# Altium schematic sheet 08 BESIDE CPU.SchDoc
size 420 x 297 mm
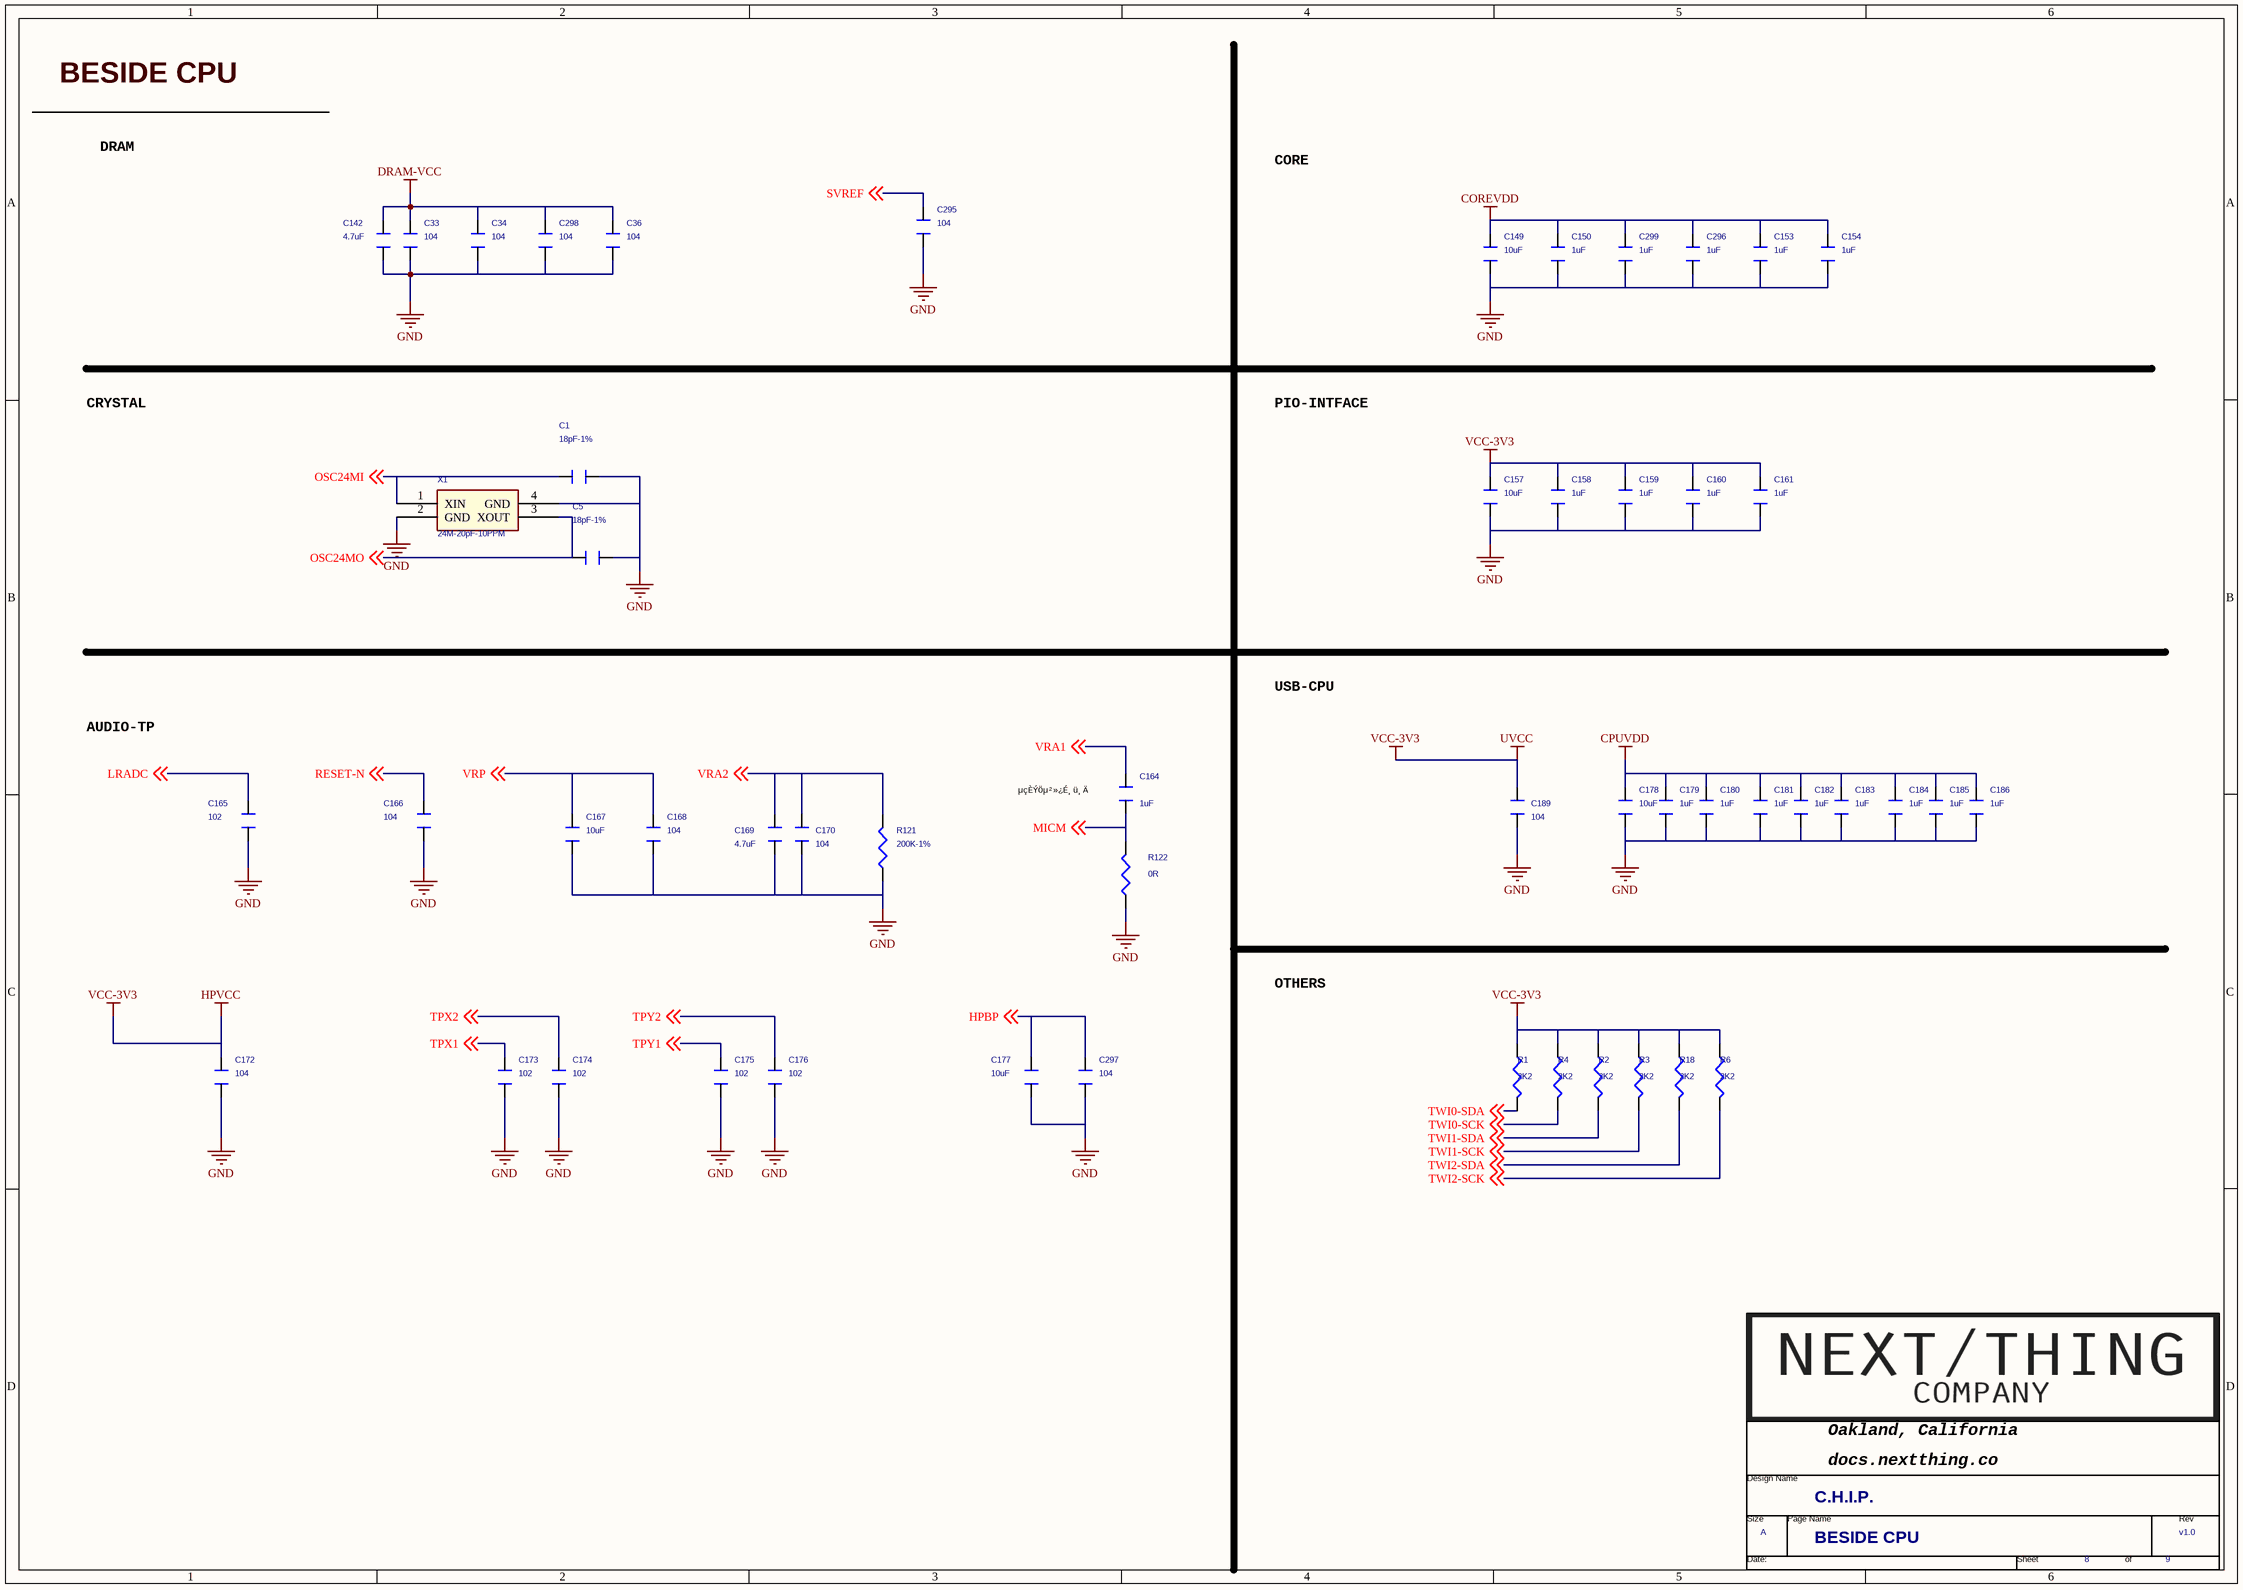
[diagram p0: 08 BESIDE CPU.SchDoc]

## Parts
*  Page Count: 9  Page Number: 8  Page Size: A  Title: C.H.I.P.  RevCode: v1.0  Doc: BESIDE CPU  (hidden comment: TitleBlock1-nextthing)  (graphical)
C1  18pF-1%  [C0201]
C5  18pF-1%  [C0201]
C33  104  [C0201]
C34  104  [C0201]
C36  104  [C0201]
C142  4.7uF  [C0402]
C149  10uF  [C0603]
C150  1uF  [C0402]
C153  1uF  [C0402]
C154  1uF  [C0402]
C157  10uF  [C0603]
C158  1uF  [C0402]
C159  1uF  [C0402]
C160  1uF  [C0402]
C161  1uF  [C0402]
C164  1uF  [C0402]
C165  102  [C0201]
C166  104  [C0201]
C167  10uF  [C0603]
C168  104  [C0201]
C169  4.7uF  [C0402]
C170  104  [C0201]
C172  104  [C0201]
C173  102  [C0201]
C174  102  [C0201]
C175  102  [C0201]
C176  102  [C0201]
C177  10uF  [C0603]
C178  10uF  [C0603]
C179  1uF  [C0402]
C180  1uF  [C0402]
C181  1uF  [C0402]
C182  1uF  [C0402]
C183  1uF  [C0402]
C184  1uF  [C0402]
C185  1uF  [C0402]
C186  1uF  [C0402]
C189  104  [C0201]
C295  104  [C0201]
C296  1uF  [C0402]
C297  104  [C0201]
C298  104  [C0201]
C299  1uF  [C0402]
R1  2K2  [C0201]
R2  2K2  [C0201]
R3  2K2  [C0201]
R4  2K2  [C0201]
R6  2K2  [C0201]
R18  2K2  [C0201]
R121  200K-1%  [C0201]
R122  0R  [C0201]
X1  24M-20pF-10PPM  [CRY-3225]

## Nets
COREVDD: C149.1 C150.1 C153.1 C154.1 C296.1 C299.1
CPUVDD: C178.1 C179.1 C180.1 C181.1 C182.1 C183.1 C184.1 C185.1 C186.1
DRAM-VCC: C33.2 C34.2 C36.2 C142.2 C298.2
GND: C1.1 C5.1 C33.1 C34.1 C36.1 C142.1 C149.2 C150.2 C153.2 C154.2 C157.2 C158.1 C159.1 C160.1 C161.1 C165.1 C166.1 C167.1 C168.1 C169.1 C170.1 C172.1 C173.1 C174.1 C175.1 C176.1 C177.1 C178.2 C179.2 C180.2 C181.2 C182.2 C183.2 C184.2 C185.2 C186.2 C189.1 C295.1 C296.2 C297.1 C298.1 C299.2 R121.1 R122.1 X1.2(GND) X1.4(GND)
HPVCC: C157.1 C158.2 C159.2 C160.2 C161.2 C172.2 C189.2 R1.1 R2.1 R3.1 R4.1 R6.1 R18.1  [also labelled UVCC, VCC-3V3]
HPBP: C177.2 C297.2 ; off-sheet HPBP
LRADC: C165.2 ; off-sheet LRADC
MICM: C164.1 R122.2 ; off-sheet MICM
OSC24MI: C1.2 X1.1(XIN) ; off-sheet OSC24MI
OSC24MO: C5.2 X1.3(XOUT) ; off-sheet OSC24MO
RESET-N: C166.2 ; off-sheet RESET-N
SVREF: C295.2 ; off-sheet SVREF
TPX1: C173.2 ; off-sheet TPX1
TPX2: C174.2 ; off-sheet TPX2
TPY1: C175.2 ; off-sheet TPY1
TPY2: C176.2 ; off-sheet TPY2
TWI0-SCK: R4.2 ; off-sheet TWI0-SCK
TWI0-SDA: R1.2 ; off-sheet TWI0-SDA
TWI1-SCK: R3.2 ; off-sheet TWI1-SCK
TWI1-SDA: R2.2 ; off-sheet TWI1-SDA
TWI2-SCK: R6.2 ; off-sheet TWI2-SCK
TWI2-SDA: R18.2 ; off-sheet TWI2-SDA
VRA1: C164.2 ; off-sheet VRA1
VRA2: C169.2 C170.2 R121.2 ; off-sheet VRA2
VRP: C167.2 C168.2 ; off-sheet VRP

## Notes on the sheet
- BESIDE CPU
- DRAM
- CORE
- CRYSTAL
- PIO-INTFACE
- AUDIO-TP
- USB-CPU
- µçÈÝÖµ²»¿É¸ü¸Ä
- OTHERS
- (in symbol TitleBlock1-nextthing) Oakland, California; Design Name; docs.nextthing.co /; Size; Page Name; Rev; Date:; Sheet; of

## Library data of the parts
C1 C5 C33 C34 C36 C142 C158-C161 C167 C173-C177 C295 C297 C298 = CAPACITOR_0_Dup4: PAGE: 2
C149 C150 C153 C154 C157 C178-C186 C296 C299 = CAPACITOR_0_Dup3: PAGE: 1
C164-C166 C168-C170 = CAPACITOR_0_Dup4
C172 C189 = CAPACITOR_0_Dup4: PAGE: 3
R1-R4 R6 R18 R121 R122 = R_Dup2
X1 = CRYSTAL-4_3: Crystal 24MHz 20pF 10ppm  -30 to +85; PART NUMBER: 7M24000004; Vendor: TXC; SPREADWIN PN: U3000019A
* = TitleBlock1-nextthing: Page Create Date: March  8, 1995